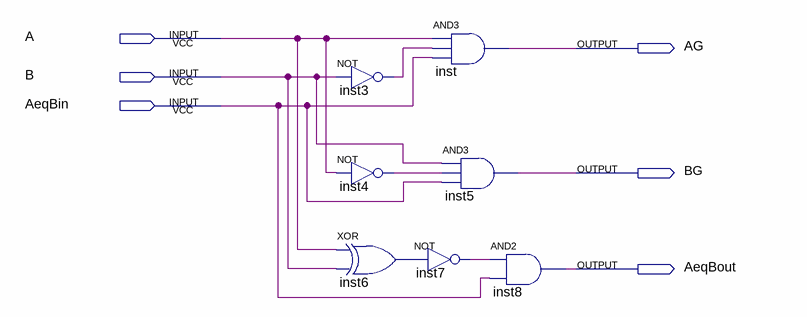
[diagram p0: schematic sheet]
// Quartus schematic comparador.bdf as structural Verilog: 7 symbols, 6 pins
module comparador (
  input  A,
  input  B,
  input  AeqBin,
  output AG,
  output BG,
  output AeqBout
);

  wire inst3_out, inst4_out, inst6_out, inst7_out;

  not inst3 (inst3_out, B);
  not inst4 (inst4_out, A);
  xor inst6 (inst6_out, A, B);
  and inst (AG, A, inst3_out, AeqBin);
  and inst5 (BG, B, inst4_out, AeqBin);
  not inst7 (inst7_out, inst6_out);
  and inst8 (AeqBout, inst7_out, AeqBin);
endmodule
